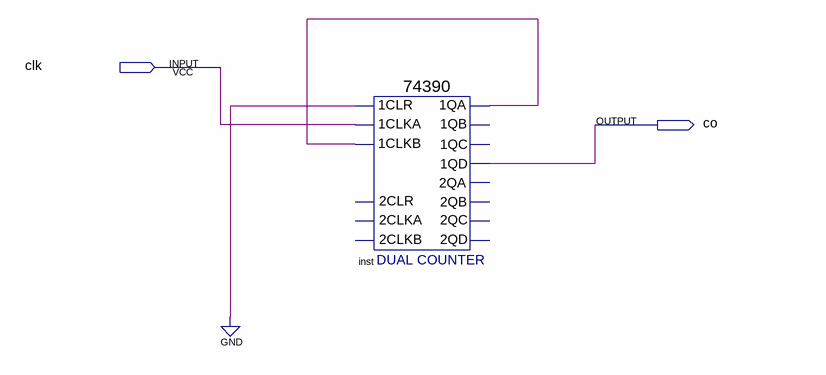
[diagram p0: schematic sheet]
// Quartus schematic m10.bdf as structural Verilog: 1 symbols, 2 pins
module m10 (
  input  clk,
  output co
);

  wire inst_1qa;

  \74390  inst (
    .\1CLR (1'b0), .\1CLKA (clk), .\1CLKB (inst_1qa), .\1QA (inst_1qa), .\1QD (co));  // open: 2CLKA, 2CLR, 2CLKB, 1QB, 1QC, 2QA, 2QB, 2QC, 2QD
endmodule
